# EAGLE design untitled (EAGLE 9.6.1)
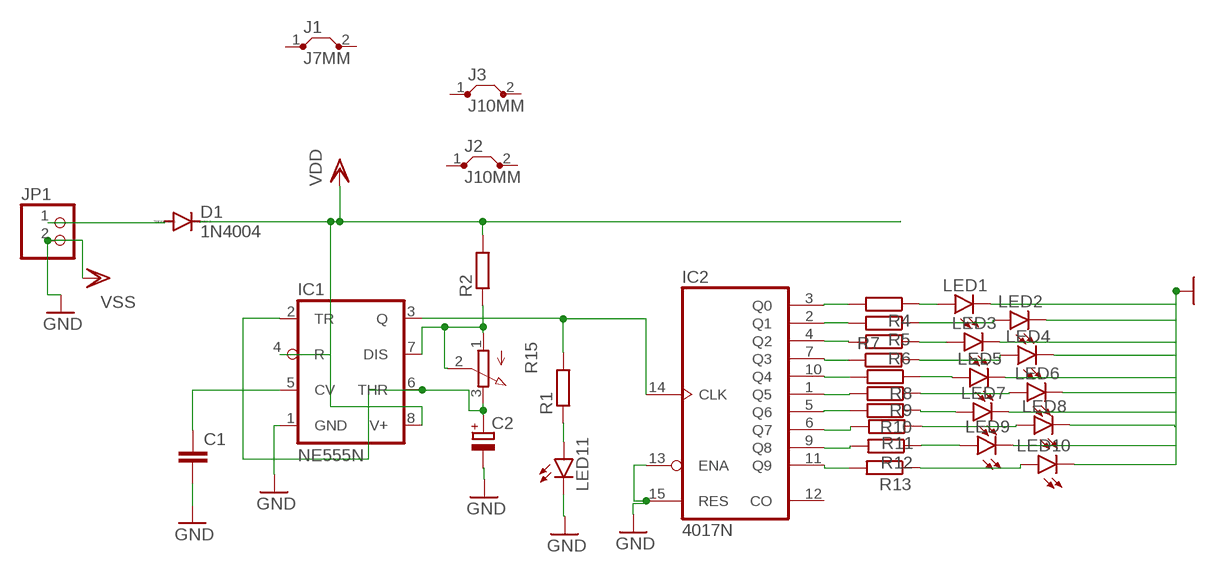
[diagram p0: schematic, sheet 1]

## Parts
C1  C-EU025-024X044  [C025-024X044]
C2  CPOL-EUE2.5-5  [E2,5-5]
D1  1N4004  [DO41-10]
IC1  NE555N  [DIL08]
IC2  4017N  [DIL16]
J1  J7MM  [07]
J2  J10MM  [10]
J3  J10MM  [10]
JP1  PINHD-1X2  [1X02]
LED1  LED5MM  [LED5MM]
LED2  LED5MM  [LED5MM]
LED3  LED5MM  [LED5MM]
LED4  LED5MM  [LED5MM]
LED5  LED5MM  [LED5MM]
LED6  LED5MM  [LED5MM]
LED7  LED5MM  [LED5MM]
LED8  LED5MM  [LED5MM]
LED9  LED5MM  [LED5MM]
LED10  LED5MM  [LED5MM]
LED11  LED5MM  [LED5MM]
R1  R-EU_0207/7  [0207/7]
R2  R-EU_0207/7  [0207/7]
R4  R-EU_0207/7  [0207/7]
R5  R-EU_0207/7  [0207/7]
R6  R-EU_0207/7  [0207/7]
R7  R-EU_0207/7  [0207/7]
R8  R-EU_0207/7  [0207/7]
R9  R-EU_0207/7  [0207/7]
R10  R-EU_0207/7  [0207/7]
R11  R-EU_0207/7  [0207/7]
R12  R-EU_0207/7  [0207/7]
R13  R-EU_0207/7  [0207/7]
R15  3RP/1610N  [3RP/1610N]

## Nets
GND: C1.2 C2.- IC1.1(GND) IC2.13(ENA) IC2.15(RES) LED1.K(C) LED2.K(C) LED3.K(C) LED4.K(C) LED5.K(C) LED6.K(C) LED7.K(C) LED8.K(C) LED9.K(C) LED10.K(C) LED11.K(C)
N$1: LED11.A R1.1
N$2: C1.1 IC1.5(CV)
N$3: D1.A JP1.1
N$4: IC2.3(Q0) R4.2
N$5: C2.+ IC1.2(TR) IC1.6(THR) R15.3(E)
N$6: IC1.7(DIS) R2.1 R15.1(A) R15.2(S)
N$8: IC1.3(Q) IC2.14(CLK) R1.2
N$9: LED1.A R4.1
N$10: LED2.A R5.1
N$11: IC2.2(Q1) R5.2
N$12: IC2.4(Q2) R6.2
N$13: LED3.A R6.1
N$14: IC2.7(Q3) R7.1
N$15: IC2.10(Q4) R8.2
N$16: IC2.1(Q5) R9.2
N$17: IC2.5(Q6) R10.2
N$18: IC2.6(Q7) R11.2
N$19: IC2.9(Q8) R12.2
N$20: IC2.11(Q9) R13.2
N$21: LED10.A R13.1
N$22: LED9.A R12.1
N$23: LED8.A R11.1
N$24: LED7.A R10.1
N$25: LED6.A R9.1
N$26: LED5.A R8.1
N$27: LED4.A R7.2
VDD: D1.C IC1.4(R) IC1.8(V+) R2.2
VSS: JP1.2 ; supply symbol labelled GND
Unconnected: IC2.12(CO) J1.1 J1.2 J2.1 J2.2 J3.1 J3.2

## Power pins joined to a net without a drawn wire
VDD: IC2.16(VDD)
VSS: IC2.8(VSS)

## Library data of the parts
C1 = rcl:C-EU: CAPACITOR, European symbol; SPICEPREFIX: C
C2 = rcl:CPOL-EU: POLARIZED CAPACITOR, European symbol; SPICEPREFIX: C
D1 = diode:1N4004: DIODE general purpose rectifier, 1 A
IC1 = linear:*555: TIMER
IC2 = 40xx:4017: COUNTER/DIVIDER
J1-J3 = jumper:J: Bridge
JP1 = pinhead:PINHD-1X2: PIN HEADER
LED1-LED11 = led:LED: LED OSRAM: - CHIPLED LG R971, LG N971, LY N971, LG Q971, LY Q971, LO R971, LY R971 LH N974, LH R974 LS Q976, LO Q976, LY Q976 LO Q996 - Hyper CHIPLED LW Q18S LB Q993, LB Q99A, LB R99A - SideLED LS A670, LO A670, LY A670, LG A670, LP A670 LB A673, LV A673, LT A673, LW A673 LH A674 LY A675 LS A676, LA A676, LO A676, LY A676, LW A676 LS A679, LY A679, LG A679 - Hyper Micro SIDELED® LS Y876, LA Y876, LO Y876, LY Y876 LT Y87S - SmartLED LW L88C, LW L88S LB L89C, LB L89S, LG L890 LS L89K, LO L89K, LY L89K LS L896, LA L896, LO L896, LY L896 - TOPLED LS T670, LO T670, LY T670, LG T670, LP T670 LSG T670, LSP T670, LSY T670, LOP T670, LYG T670 LG T671, LOG T671, LSG T671 LB T673, LV T673, LT T673, LW T673 LH T674 LS T676, LA T676, LO T676, LY T676, LB T676, LH T676, LSB T676, LW T676 LB T67C, LV T67C, LT T67C, LS T67K, LO T67K, LY T67K, LW E67C LS E67B, LA E67B, LO E67B, LY E67B, LB E67C, LV E67C, LT E67C LW T67C LS T679, LY T679, LG T679 LS T770, LO T770, LY T770, LG T770, LP T770 LB T773, LV T773, LT T773, LW T773 LH T774 LS E675, LA E675, LY E675, LS T675 LS T776, LA T776, LO T776, LY T776, LB T776 LHGB T686 LT T68C, LB T68C - Hyper Mini TOPLED® LB M676 - Mini TOPLED Santana® LG M470 LS M47K, LO M47K, LY M47K Source: http://www.osram.convergy.de LUXEON: - LUMILED® LXK2-PW12-R00, LXK2-PW12-S00, LXK2-PW14-U00, LXK2-PW14-V00 LXK2-PM12-R00, LXK2-PM12-S00, LXK2-PM14-U00 LXK2-PE12-Q00, LXK2-PE12-R00, LXK2-PE12-S00, LXK2-PE14-T00, LXK2-PE14-U00 LXK2-PB12-K00, LXK2-PB12-L00, LXK2-PB12-M00, LXK2-PB14-N00, LXK2-PB14-P00, LXK2-PB14-Q00 LXK2-PR12-L00, LXK2-PR12-M00, LXK2-PR14-Q00, LXK2-PR14-R00 LXK2-PD12-Q00, LXK2-PD12-R00, LXK2-PD12-S00 LXK2-PH12-R00, LXK2-PH12-S00 LXK2-PL12-P00, LXK2-PL12-Q00, LXK2-PL12-R00 Source: www.luxeon.com KINGBRIGHT: KA-3528ASYC Source: www.kingbright.com
R1 R2 R4-R13 = rcl:R-EU_: RESISTOR, European symbol; SPICEPREFIX: R
R15 = pot:3RP/1610N: 16mm Potentiometer one level Source: http://www.alphapotentiometers.net/html/16mm_pot_2.html

## Board
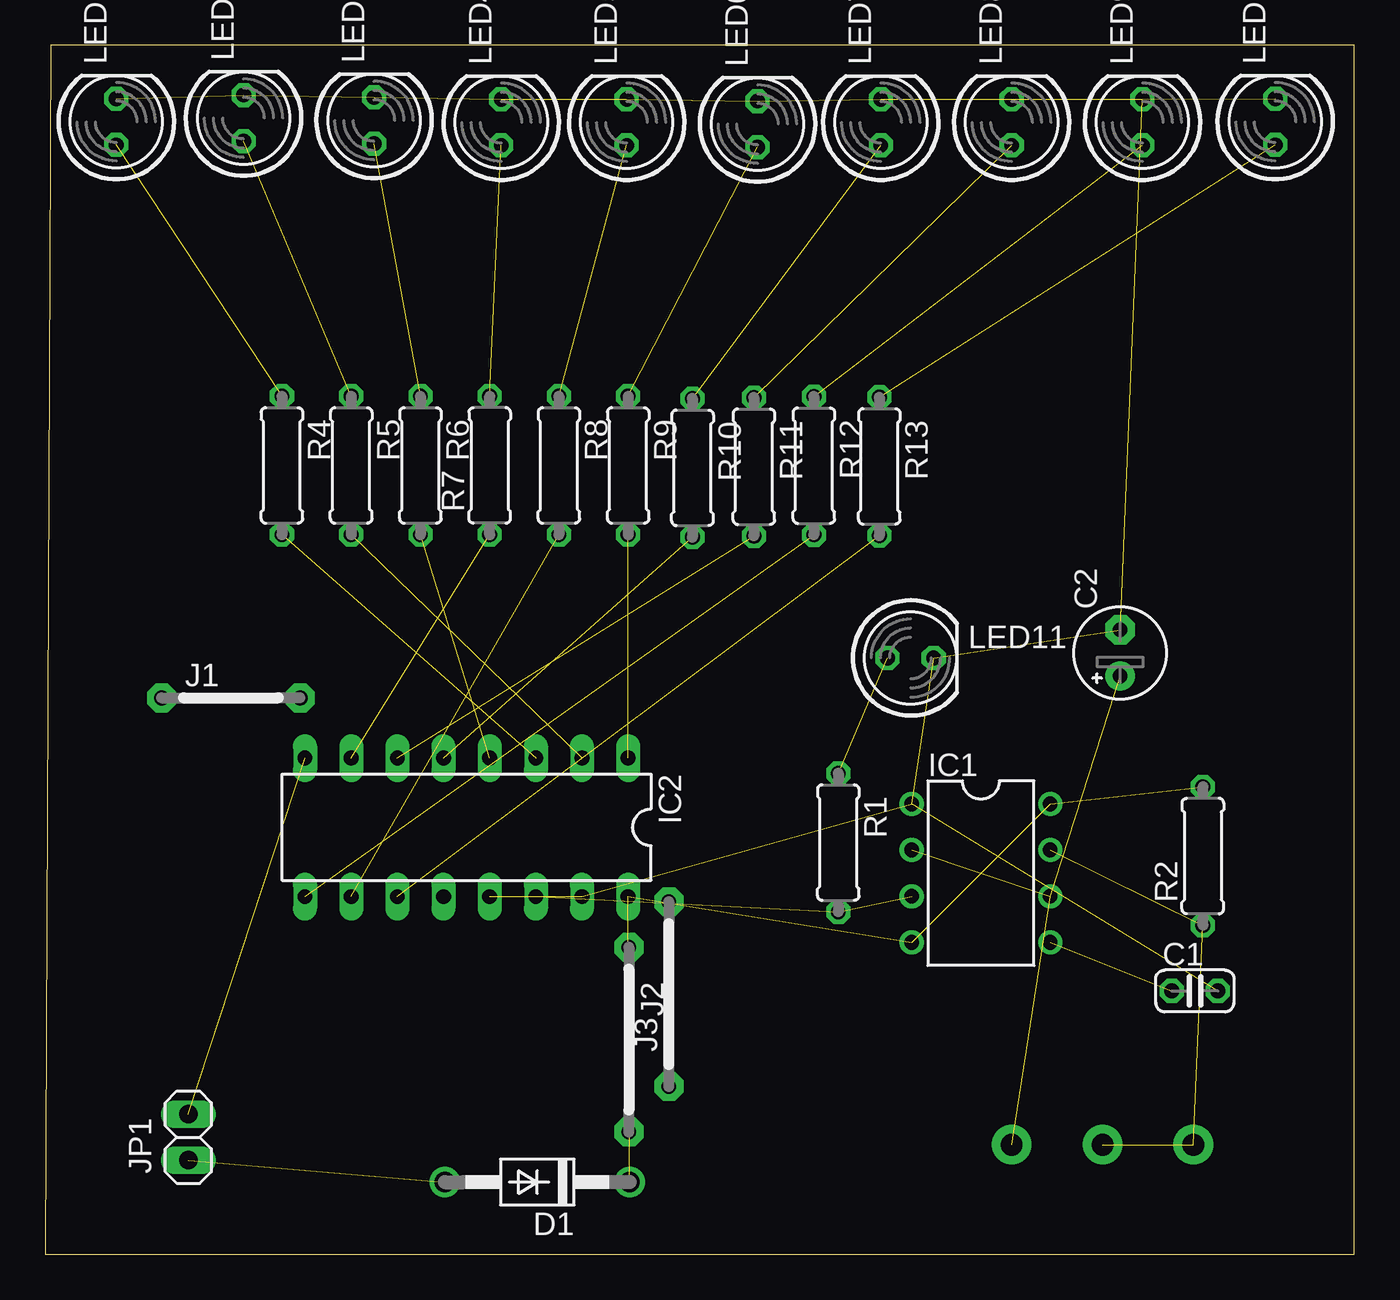
[diagram p1: board, top side]
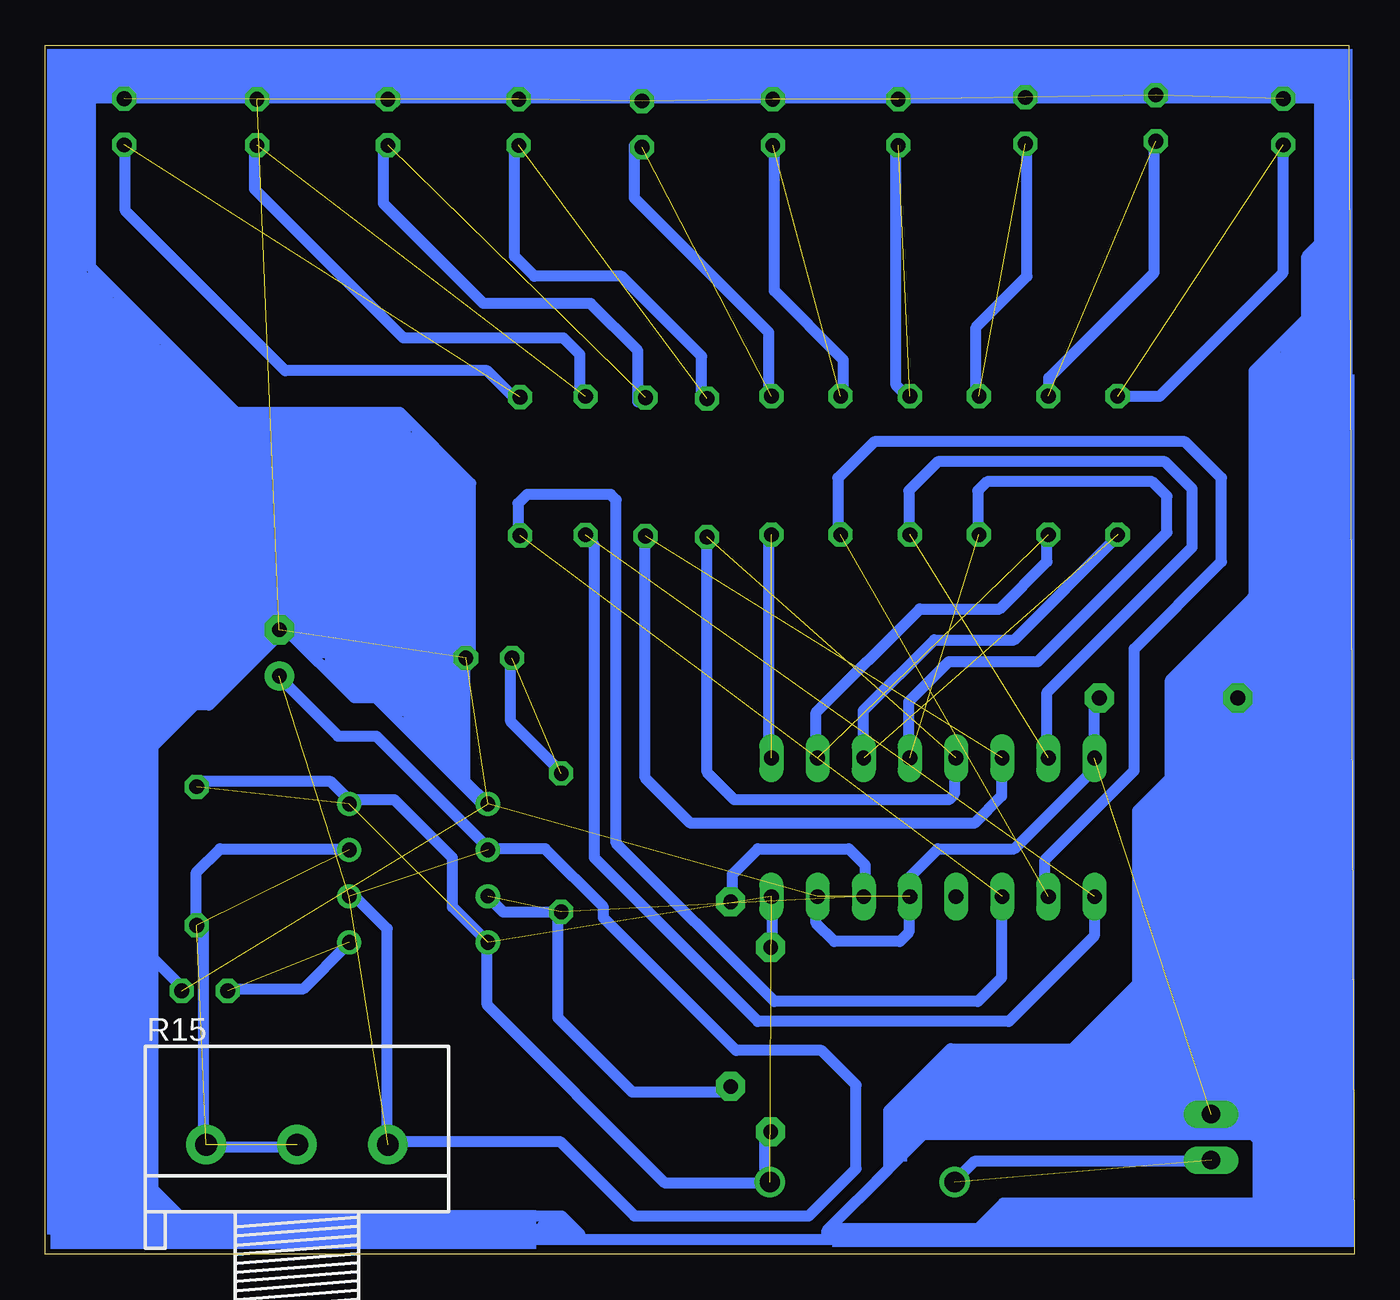
[diagram p2: board, bottom side, seen from below]

Size 72 x 66.5 mm. Coordinates in mm from the lower left corner, seen from the top.
Outline: 0,0 72,0 72,66.5 0.3,66.5 0,0
Copper layers (1*16): Top 0.035mm / dielectric 1.5mm / Bottom 0.035mm
Design rules "default": minimum track width 6mil, minimum drill 0.35mm, track to track 6mil, track to pad 6mil, pad to pad 6mil, via to via 6mil, smd to smd 6mil, copper to edge 40mil, drill to drill 6mil, minimum pad ring 10mil, minimum via ring 8mil, stop-mask expansion 4mil, vias tented up to drill 0mil, thermal gap 10mil

### Footprints (pad centres in the part's own frame; a part is rotated, then mirrored left to right if it is on the bottom)
C025-024X044 = drill 0.813 octagon: 1 -1.27,0; 2 1.27,0
E2,5-5 = drill 0.813 pad 1.6: + -1.27,0 | drill 0.813 pad 1.6 octagon: - 1.27,0
DO41-10 = drill 1.118: A 5.08,0; C -5.08,0
DIL08 = drill 0.813 pad 1.27: 1 -3.81,-3.81; 2 -1.27,-3.81; 3 1.27,-3.81; 4 3.81,-3.81; 5 3.81,3.81; 6 1.27,3.81; 7 -1.27,3.81; 8 -3.81,3.81
DIL16 = drill 0.813 long: 1 -8.89,-3.81; 2 -6.35,-3.81; 3 -3.81,-3.81; 4 -1.27,-3.81; 5 1.27,-3.81; 6 3.81,-3.81; 7 6.35,-3.81; 8 8.89,-3.81; 9 8.89,3.81; 10 6.35,3.81; 11 3.81,3.81; 12 1.27,3.81; 13 -1.27,3.81; 14 -3.81,3.81; 15 -6.35,3.81; 16 -8.89,3.81
07 = drill 0.813 pad 1.6 octagon: 1 -3.81,0; 2 3.81,0
10 = drill 0.813 pad 1.6 octagon: 1 -5.08,0; 2 5.08,0
1X02 = drill 1.016 long: 1 -1.27,0; 2 1.27,0
LED5MM = drill 0.813 octagon: A -1.27,0; K 1.27,0
0207/7 = drill 0.813 octagon: 1 -3.81,0; 2 3.81,0
3RP/1610N = drill 1.2 pad 2.184: 1 -5,0; 2 0,0; 3 5,0

### Placement (x,y rotation side)
C1  63.24,14.48 0 top
C2  59.13,33.08 90 top
D1  27.06,3.96 180 top
IC1  51.47,20.96 270 top
IC2  23.17,23.48 180 top
J1  10.2,30.6 0 top
J2  32.1,11.8 270 top
J3  34.3,14.3 90 top
JP1  7.86,6.43 90 top
LED1  3.9,62.3 90 top
LED2  10.9,62.5 90 top
LED3  18.08,62.37 90 top
LED4  25.08,62.27 90 top
LED5  31.98,62.27 90 top
LED6  39.18,62.17 90 top
LED7  45.96,62.27 90 top
LED8  53.16,62.27 90 top
LED9  60.36,62.27 90 top
LED10  67.66,62.3 90 top
LED11  47.6,32.8 0 top
R1  43.62,22.64 270 top
R2  63.68,21.9 90 top
R4  13.01,43.39 270 top
R5  16.82,43.39 270 top
R6  20.63,43.39 270 top
R7  24.44,43.39 90 top
R8  28.25,43.39 270 top
R9  32.06,43.39 270 top
R10  35.6,43.26 270 top
R11  38.98,43.32 270 top
R12  42.28,43.38 270 top
R13  45.88,43.34 270 top
R15  58.16,6.02 0 bottom

### Tracks (layer width: path | path; a pad name or v marks a point on that pad's centre or on a via)
GND  (15 unrouted)
N$1  (1 unrouted)
N$2  (1 unrouted)
N$3  (1 unrouted)
N$4  (1 unrouted)
N$5  (3 unrouted)
N$6  (3 unrouted)
N$7
  Bottom 0.61: 24.5,27.3 24.5,30.4 22.3,32.6 17.4,32.6 10.3,39.7 10.3,41.7 11.1,42.5 20.2,42.5 20.7,42 20.7,39.7
N$8  (2 unrouted)
N$9  (1 unrouted)
N$10  (1 unrouted)
N$11  (1 unrouted)
N$12  (1 unrouted)
N$13  (1 unrouted)
N$14  (1 unrouted)
N$15  (1 unrouted)
N$16  (1 unrouted)
N$17  (1 unrouted)
N$18  (1 unrouted)
N$19  (1 unrouted)
N$20  (1 unrouted)
N$21  (1 unrouted)
N$22  (1 unrouted)
N$23  (1 unrouted)
N$24  (1 unrouted)
N$25  (1 unrouted)
N$26  (1 unrouted)
N$27  (1 unrouted)
N$28
  Bottom 0.61: 16.9,27.1 16.9,30.9 8.9,38.9 8.9,42.1 10.4,43.6 22.9,43.6 24.5,42 24.5,39.7
N$29
  Bottom 0.61: 17,19.7 17,21.7 12.1,26.6 12.1,33.3 7.3,38.1 7.3,42.7 9.3,44.7 26.4,44.7 28.4,42.7 28.4,39.6
N$30
  Bottom 0.61: 13.1,47.2 10.7,47.2 3.9,54 3.9,60.9
N$31
  Bottom 0.61: 16.8,47.4 16.8,48.2 11,54 11,61
N$32
  Bottom 0.61: 20.8,47 20.8,51 18,53.8 18,60.8
N$33
  Bottom 0.61: 24.6,47.2 25.2,47.8 25.2,60.8 25.1,60.8
N$34
  Bottom 0.61: 28.1,47.4 28.1,49.2 31.9,53 31.9,60.7
N$35
  Bottom 0.61: 32.2,47.3 32.2,50.7 39.6,58.1 39.6,61
N$36
  Bottom 0.61: 35.9,46.9 35.9,49.4 40.3,53.8 45.1,53.8 46.2,54.9 46.2,61
N$37
  Bottom 0.61: 32.2,27.3 32.2,39.5 32.1,39.6
N$38
  Bottom 0.61: 29.6,27.3 29.6,29.8 23.9,35.5 19.5,35.5 16.9,38.1 16.9,39.6
N$39
  Bottom 0.61: 27,27.3 27,29.9 23.1,33.8 18.7,33.8 13,39.5
N$40
  Bottom 0.61: 14.3,19.4 14.3,17.5 19,12.8 32.8,12.8 41.8,21.8 41.8,39 42.2,39.4
N$41
  Bottom 0.61: 19.4,27.2 19.4,25.2 20.9,23.7 36.5,23.7 39,26.2 39,39.5
N$42
  Bottom 0.61: 22,27.4 22,25.3 22.3,25 34.1,25 35.6,26.5 35.6,39.5
N$43
  Bottom 0.61: 24.5,19.6 24.5,17.7 25,17.2 28.6,17.2 29.6,18.2 29.6,19.9
N$44
  Bottom 0.61: 24.6,19.5 24.6,20.6 22.9,22.3 18.7,22.3 14.3,26.7 14.3,27.4
N$45
  Bottom 0.61: 19.4,19.6 19.4,15.2 20.7,13.9 31.9,13.9 40.6,22.6 40.6,41.5 40.9,41.8 45.5,41.8 46,41.3 46,39.7
N$46
  Bottom 0.61: 39.4,46.9 39.4,49.7 42,52.3 47.9,52.3 53.4,57.8 53.4,60.9
N$47
  Bottom 0.61: 42.6,47 42.6,49.5 43.5,50.4 52.3,50.4 60.5,58.6 60.5,61
N$48
  Bottom 0.61: 46.2,47.1 47.7,48.6 58.8,48.6 67.6,57.4 67.6,60.8
N$49
  Bottom 0.61: 32.2,3.9 37.9,3.9 47.7,13.7 47.7,17.2 49.6,19.1 49.6,21.8 52.8,25 55.2,25
N$50
  Bottom 0.61: 53.4,6.2 53.2,6.2 | 53.2,6.2 43.7,6.2 39.6,2.1 30,2.1 27.4,4.7 27.4,9.3 29.3,11.2 34,11.2 41.3,18.5 41.3,19.1 44.5,22.3 47.6,22.3 | 53.2,6.2 53.2,17.9 55.1,19.8
N$51
  Bottom 0.61: 43.6,18.8 46.8,18.8 47.7,19.7
N$52
  Bottom 0.61: 43.6,26.5 46.4,29.3 46.4,32.9
N$53
  Bottom 0.61: 47.6,24.7 48.9,26 48.9,32.7
N$54
  Bottom 0.61: 63.6,26 56.3,26 55.2,24.9 55,24.9
N$55
  Bottom 0.61: 59.1,31.7 55.9,28.5 53.8,28.5 47.6,22.3 47.6,22.2
N$56
  Bottom 0.61: 62.2,14.6 57.8,14.6 55.4,17
N$57
  Bottom 0.61: 63.3,6 63.2,5.9 58.1,5.9
N$58
  Bottom 0.61: 63.2,6.1 63.3,6.2 63.3,17.8 63.7,18.2 63.7,21 62.4,22.3 55.3,22.3
N$59
  Bottom 0.61: 7.9,5.1 20.9,5.1 22.1,3.9
N$60
  Bottom 0.61: 14.3,27.5 14.3,30.7 14.2,30.8
N$61
  Bottom 0.61: 48.9,32.8 50.5,34.4 59.1,34.4
N$62
  Bottom 0.61: 58.9,34.3 63,30.2 63.8,30.2 66.1,27.9 66.1,16.3 | 8.2,7.6 7.2,6.6 5.6,6.6 5.3,6.3 5.3,2.8 19.3,2.8 20.7,1.4 28.6,1.4 29.2,0.8 63.3,0.8 70,7.5 70,20.2 | 59.5,34.5 70,45 | 70,45 70,63.6 1.2,63.6 1.2,7.8 7.8,7.8 | 8,7.8 7.9,7.8 | 7.9,7.8 7.8,7.8 | 64.3,14.5 64.9,15.1 66.1,16.3 | 66.1,16.3 70,20.2 | 70,20.2 70,45 | 7.9,7.8 7.9,33.8 5.5,36.2 5.5,48.6 2.6,51.5 2.6,54.9 1.8,55.7 1.8,63.3 | 6.3,30.4 6.3,9.3 7.8,7.8
N$63
  Bottom 0.61: 32.4,4.3 32.4,6.3 32,6.7
N$64
  Bottom 0.61: 32,17.1 32,19.3
N$65
  Bottom 0.61: 34.4,8.9 39.7,8.9 43.8,13 43.8,18.7
N$66
  Bottom 0.61: 34.2,19.4 34.2,20.9 32.8,22.3 27.8,22.3 26.9,21.4 26.9,19.8
N$67
  Bottom 0.61: 47.5,24.8 48,24.8 53.8,30.6 55,30.6 58.8,34.4 59.3,34.4
N$68
  Bottom 0.61: 48.6,32.6 48.6,42.4 52.5,46.3 61.5,46.3 69.5,54.3 69.5,63.8
N$69
  Bottom 0.61: 46.4,2.1 43.6,2.1 43.1,1.6 | 42.6,1.1 43.1,1.6 | 43.1,1.6 44.6,1.6 44.8,1.4 44.8,1.3 43.3,1.3 43.2,1.2 44.7,1.2
N$70
  Bottom 0.61: 29,0.9 29,1.3 25.6,4.7 25.6,7.9 22.2,11.3 15.5,11.3 11.9,14.9 11.9,24.4 10.1,26.2 10.1,31.6 5.6,36.1 5,36.1 5,36 5.1,35.9
N$71
  Bottom 0.61: 26.3,4 23.7,6.6 4.6,6.6
VDD  (4 unrouted)
VSS  (1 unrouted)
(copper drawn outside any net)
  shapes: Bottom area x140